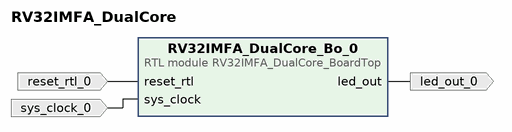
[diagram p0: block diagram of the top level]
# Vivado block design RV32IMFA_DualCore, xc7z020clg484-1, Vivado 2025.2
create_bd_design RV32IMFA_DualCore

create_bd_port -dir I -type clk sys_clock_0
create_bd_port -dir O led_out_0
create_bd_port -dir I -type rst reset_rtl_0

create_bd_cell -type module -reference RV32IMFA_DualCore_BoardTop RV32IMFA_DualCore_Bo_0

# ---- connections ----

connect_bd_net [get_bd_pins RV32IMFA_DualCore_Bo_0/led_out] [get_bd_ports led_out_0]
connect_bd_net -net reset_rtl_0_1 [get_bd_ports reset_rtl_0] [get_bd_pins RV32IMFA_DualCore_Bo_0/reset_rtl]
connect_bd_net -net sys_clock_0_1 [get_bd_ports sys_clock_0] [get_bd_pins RV32IMFA_DualCore_Bo_0/sys_clock]

validate_bd_design
save_bd_design
